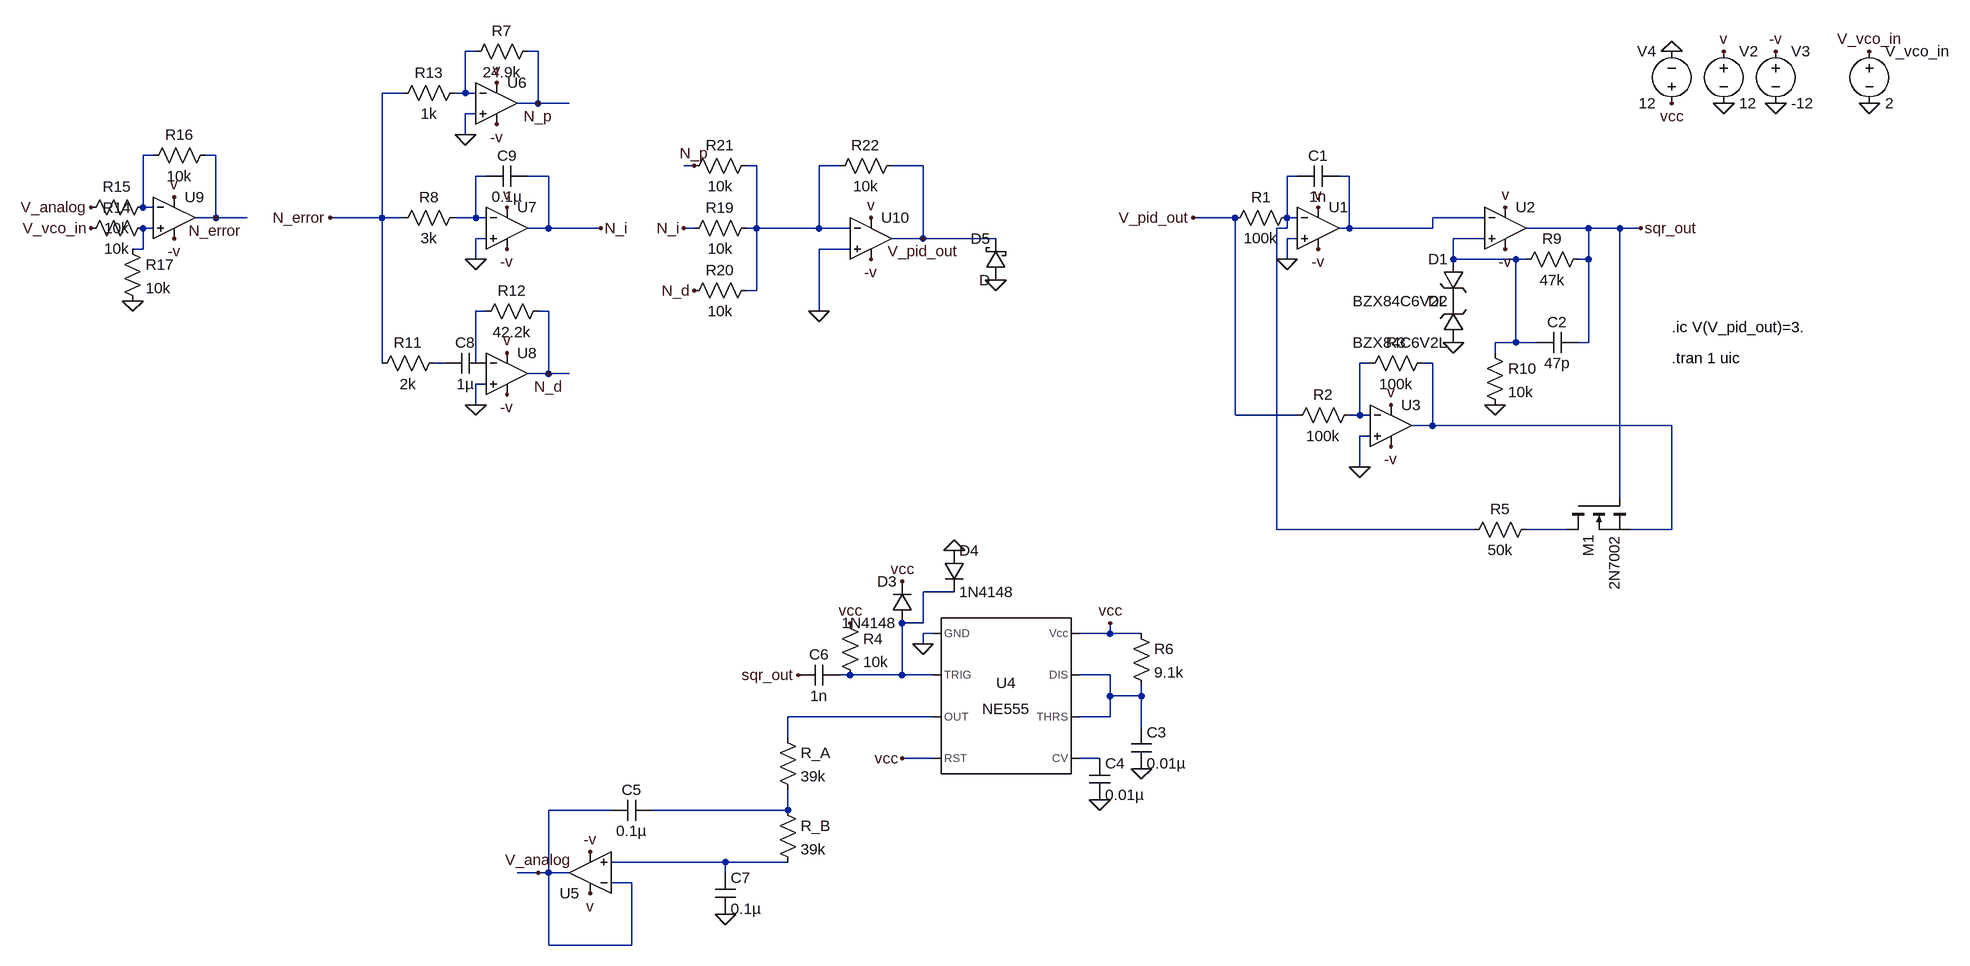
[diagram p0: schematic precision_oscillator_prll_topology.asc]
precision_oscillator_prll_topology.asc, the LTspice schematic file:
Version 4
SHEET 1 3140 2088
WIRE -1888 -1328 -1904 -1328
WIRE -1792 -1328 -1808 -1328
WIRE -2000 -1264 -2032 -1264
WIRE -1904 -1264 -1904 -1328
WIRE -1904 -1264 -1920 -1264
WIRE -1888 -1264 -1904 -1264
WIRE -1792 -1248 -1792 -1328
WIRE -1792 -1248 -1824 -1248
WIRE -1744 -1248 -1792 -1248
WIRE -1888 -1232 -1904 -1232
WIRE -1904 -1200 -1904 -1232
WIRE -2384 -1168 -2400 -1168
WIRE -2288 -1168 -2304 -1168
WIRE -1552 -1152 -1568 -1152
WIRE -1456 -1152 -1472 -1152
WIRE -1328 -1152 -1360 -1152
WIRE -1200 -1152 -1248 -1152
WIRE -1872 -1136 -1888 -1136
WIRE -1776 -1136 -1808 -1136
WIRE -624 -1136 -640 -1136
WIRE -544 -1136 -560 -1136
WIRE -2400 -1088 -2400 -1168
WIRE -2384 -1088 -2400 -1088
WIRE -2288 -1072 -2288 -1168
WIRE -2288 -1072 -2320 -1072
WIRE -2240 -1072 -2288 -1072
WIRE -2032 -1072 -2032 -1264
WIRE -2032 -1072 -2112 -1072
WIRE -2000 -1072 -2032 -1072
WIRE -1888 -1072 -1888 -1136
WIRE -1888 -1072 -1920 -1072
WIRE -1872 -1072 -1888 -1072
WIRE -720 -1072 -784 -1072
WIRE -640 -1072 -640 -1136
WIRE -624 -1072 -640 -1072
WIRE -336 -1072 -416 -1072
WIRE -2384 -1056 -2400 -1056
WIRE -1776 -1056 -1776 -1136
WIRE -1776 -1056 -1808 -1056
WIRE -1696 -1056 -1776 -1056
WIRE -1552 -1056 -1568 -1056
WIRE -1456 -1056 -1456 -1152
WIRE -1456 -1056 -1472 -1056
WIRE -1360 -1056 -1360 -1152
WIRE -1360 -1056 -1456 -1056
WIRE -1312 -1056 -1360 -1056
WIRE -640 -1056 -640 -1072
WIRE -640 -1056 -656 -1056
WIRE -544 -1056 -544 -1136
WIRE -544 -1056 -560 -1056
WIRE -416 -1056 -416 -1072
WIRE -416 -1056 -544 -1056
WIRE -176 -1056 -272 -1056
WIRE -128 -1056 -176 -1056
WIRE -96 -1056 -128 -1056
WIRE -1872 -1040 -1888 -1040
WIRE -1200 -1040 -1200 -1152
WIRE -1200 -1040 -1248 -1040
WIRE -1088 -1040 -1200 -1040
WIRE -624 -1040 -640 -1040
WIRE -336 -1040 -384 -1040
WIRE -2400 -1024 -2400 -1056
WIRE -2400 -1024 -2416 -1024
WIRE -1312 -1024 -1360 -1024
WIRE -1888 -1008 -1888 -1040
WIRE -640 -1008 -640 -1040
WIRE -384 -1008 -384 -1040
WIRE -288 -1008 -384 -1008
WIRE -272 -1008 -288 -1008
WIRE -176 -1008 -176 -1056
WIRE -176 -1008 -192 -1008
WIRE -1456 -960 -1456 -1056
WIRE -1456 -960 -1472 -960
WIRE -1872 -928 -1888 -928
WIRE -1776 -928 -1792 -928
WIRE -1360 -928 -1360 -1024
WIRE -288 -880 -288 -1008
WIRE -288 -880 -320 -880
WIRE -256 -880 -288 -880
WIRE -176 -880 -176 -1008
WIRE -176 -880 -192 -880
WIRE -320 -864 -320 -880
WIRE -2032 -848 -2032 -1072
WIRE -1936 -848 -1952 -848
WIRE -1888 -848 -1888 -928
WIRE -512 -848 -528 -848
WIRE -416 -848 -432 -848
WIRE -1776 -832 -1776 -928
WIRE -1776 -832 -1808 -832
WIRE -1744 -832 -1776 -832
WIRE -1872 -816 -1888 -816
WIRE -1888 -784 -1888 -816
WIRE -720 -768 -720 -1072
WIRE -624 -768 -720 -768
WIRE -528 -768 -528 -848
WIRE -528 -768 -544 -768
WIRE -512 -768 -528 -768
WIRE -416 -752 -416 -848
WIRE -416 -752 -448 -752
WIRE -48 -752 -416 -752
WIRE -512 -736 -528 -736
WIRE -528 -688 -528 -736
WIRE -128 -640 -128 -1056
WIRE -656 -592 -656 -1056
WIRE -352 -592 -656 -592
WIRE -208 -592 -272 -592
WIRE -48 -592 -48 -752
WIRE -48 -592 -112 -592
WIRE -1152 -496 -1200 -496
WIRE -1200 -448 -1200 -496
WIRE -1200 -448 -1232 -448
WIRE -1184 -432 -1200 -432
WIRE -912 -432 -912 -448
WIRE -912 -432 -960 -432
WIRE -864 -432 -912 -432
WIRE -1200 -416 -1200 -432
WIRE -1312 -368 -1328 -368
WIRE -1232 -368 -1232 -448
WIRE -1232 -368 -1312 -368
WIRE -1184 -368 -1232 -368
WIRE -912 -368 -960 -368
WIRE -912 -336 -912 -368
WIRE -864 -336 -864 -352
WIRE -864 -336 -912 -336
WIRE -1184 -304 -1408 -304
WIRE -912 -304 -912 -336
WIRE -912 -304 -960 -304
WIRE -864 -288 -864 -336
WIRE -1408 -272 -1408 -304
WIRE -1184 -240 -1232 -240
WIRE -928 -240 -960 -240
WIRE -1680 -160 -1776 -160
WIRE -1408 -160 -1408 -192
WIRE -1408 -160 -1616 -160
WIRE -1504 -80 -1680 -80
WIRE -1408 -80 -1504 -80
WIRE -1792 -64 -1824 -64
WIRE -1776 -64 -1776 -160
WIRE -1776 -64 -1792 -64
WIRE -1744 -64 -1776 -64
WIRE -1504 -64 -1504 -80
WIRE -1648 -48 -1680 -48
WIRE -1776 48 -1776 -64
WIRE -1648 48 -1648 -48
WIRE -1648 48 -1776 48
FLAG 32 -1248 0
FLAG 112 -1248 0
FLAG -640 -1008 0
FLAG -528 -688 0
FLAG -384 -880 0
FLAG 112 -1328 -v
FLAG 32 -1328 v
FLAG -592 -1088 v
FLAG -304 -1088 v
FLAG -480 -784 v
FLAG -592 -1024 -v
FLAG -304 -1024 -v
FLAG -480 -720 -v
FLAG -48 -1328 0
FLAG -864 -224 0
FLAG -48 -1248 vcc
FLAG -912 -448 vcc
FLAG -1232 -240 vcc
FLAG -928 -176 0
FLAG -96 -1056 sqr_out
FLAG -320 -784 0
FLAG -1312 -448 vcc
FLAG -1200 -416 0
FLAG -1232 -512 vcc
FLAG -1152 -560 0
FLAG -1392 -368 sqr_out
FLAG -1504 0 0
FLAG -1792 -64 V_analog
FLAG -1712 -96 -v
FLAG -1712 -32 v
FLAG 256 -1248 0
FLAG 256 -1328 V_vco_in
FLAG -784 -1072 V_pid_out
FLAG -1904 -1200 0
FLAG -1888 -1008 0
FLAG -1888 -784 0
FLAG -1856 -1280 v
FLAG -1840 -1088 v
FLAG -1840 -864 v
FLAG -1856 -1216 -v
FLAG -1840 -1024 -v
FLAG -1840 -800 -v
FLAG -2112 -1072 N_error
FLAG -1696 -1056 N_i
FLAG -1792 -1248 N_p
FLAG -1776 -832 N_d
FLAG -2480 -1056 V_vco_in
FLAG -2480 -1088 V_analog
FLAG -2416 -944 0
FLAG -2288 -1072 N_error
FLAG -1552 -1152 N_p
FLAG -1568 -1056 N_i
FLAG -1552 -960 N_d
FLAG -1200 -1040 V_pid_out
FLAG -1280 -1072 v
FLAG -1280 -1008 -v
FLAG -1360 -928 0
FLAG -1088 -976 0
FLAG -2352 -1104 v
FLAG -2352 -1040 -v
SYMBOL Voltage 32 -1344 R0
SYMATTR InstName V2
SYMATTR Value 12
SYMBOL Voltage 112 -1344 R0
SYMATTR InstName V3
SYMATTR Value -12
SYMBOL Res -624 -1088 R90
WINDOW 0 0 56 VBottom 2
WINDOW 3 32 56 VTop 2
SYMATTR InstName R1
SYMATTR Value 100k
SYMBOL Res -528 -784 R90
WINDOW 0 0 56 VBottom 2
WINDOW 3 32 56 VTop 2
SYMATTR InstName R2
SYMATTR Value 100k
SYMBOL Res -416 -864 R90
WINDOW 0 0 56 VBottom 2
WINDOW 3 32 56 VTop 2
SYMATTR InstName R3
SYMATTR Value 100k
SYMBOL Cap -560 -1152 R90
WINDOW 0 0 32 VBottom 2
WINDOW 3 32 32 VTop 2
SYMATTR InstName C1
SYMATTR Value 1n
SYMBOL zener -368 -1008 M0
SYMATTR InstName D1
SYMATTR Value BZX84C6V2L
SYMBOL zener -368 -880 R180
WINDOW 0 24 64 Left 2
WINDOW 3 24 0 Left 2
SYMATTR InstName D2
SYMATTR Value BZX84C6V2L
SYMBOL nmos -208 -640 M90
SYMATTR InstName M1
SYMATTR Value 2N7002
SYMBOL Res -256 -608 R90
WINDOW 0 0 56 VBottom 2
WINDOW 3 32 56 VTop 2
SYMATTR InstName R5
SYMATTR Value 50k
SYMBOL OpAmps/UniversalOpAmp2 -592 -1056 R0
SYMATTR InstName U1
SYMBOL OpAmps/UniversalOpAmp2 -304 -1056 R0
SYMATTR InstName U2
SYMBOL OpAmps/UniversalOpAmp2 -480 -752 R0
SYMATTR InstName U3
SYMBOL Misc/NE555 -1072 -336 R0
SYMATTR InstName U4
SYMBOL Cap -880 -288 R0
SYMATTR InstName C3
SYMATTR Value 0.01µ
SYMBOL Voltage -48 -1232 R180
WINDOW 0 24 96 Left 2
WINDOW 3 24 16 Left 2
SYMATTR InstName V4
SYMATTR Value 12
SYMBOL Res -880 -448 R0
SYMATTR InstName R6
SYMATTR Value 9.1k
SYMBOL Cap -944 -240 R0
SYMATTR InstName C4
SYMATTR Value 0.01µ
SYMBOL Res -176 -1024 R90
WINDOW 0 0 56 VBottom 2
WINDOW 3 32 56 VTop 2
SYMATTR InstName R9
SYMATTR Value 47k
SYMBOL Cap -192 -896 R90
WINDOW 0 0 32 VBottom 2
WINDOW 3 32 32 VTop 2
SYMATTR InstName C2
SYMATTR Value 47p
SYMBOL Res -336 -880 R0
SYMATTR InstName R10
SYMATTR Value 10k
SYMBOL Cap -1328 -384 R90
WINDOW 0 0 32 VBottom 2
WINDOW 3 32 32 VTop 2
SYMATTR InstName C6
SYMATTR Value 1n
SYMBOL Res -1328 -464 R0
SYMATTR InstName R4
SYMATTR Value 10k
SYMBOL diode -1216 -448 R180
WINDOW 0 24 64 Left 2
WINDOW 3 24 0 Left 2
SYMATTR InstName D3
SYMATTR Value 1N4148
SYMBOL diode -1168 -560 R0
SYMATTR InstName D4
SYMATTR Value 1N4148
SYMBOL OpAmps/UniversalOpAmp2 -1712 -64 R180
SYMATTR InstName U5
SYMBOL Res -1424 -288 R0
SYMATTR InstName R_A
SYMATTR Value 39k
SYMBOL Cap -1616 -176 R90
WINDOW 0 0 32 VBottom 2
WINDOW 3 32 32 VTop 2
SYMATTR InstName C5
SYMATTR Value 0.1µ
SYMBOL Cap -1520 0 M180
WINDOW 0 24 56 Left 2
WINDOW 3 24 8 Left 2
SYMATTR InstName C7
SYMATTR Value 0.1µ
SYMBOL Res -1424 -176 R0
SYMATTR InstName R_B
SYMATTR Value 39k
SYMBOL Voltage 256 -1344 R0
SYMATTR InstName V_vco_in
SYMATTR Value 2
SYMBOL OpAmps/UniversalOpAmp2 -1856 -1248 R0
SYMATTR InstName U6
SYMBOL OpAmps/UniversalOpAmp2 -1840 -1056 R0
SYMATTR InstName U7
SYMBOL OpAmps/UniversalOpAmp2 -1840 -832 R0
SYMATTR InstName U8
SYMBOL Res -1792 -1344 R90
WINDOW 0 0 56 VBottom 2
WINDOW 3 32 56 VTop 2
SYMATTR InstName R7
SYMATTR Value 24.9k
SYMBOL Res -1904 -1088 R90
WINDOW 0 0 56 VBottom 2
WINDOW 3 32 56 VTop 2
SYMATTR InstName R8
SYMATTR Value 3k
SYMBOL Res -1936 -864 R90
WINDOW 0 0 56 VBottom 2
WINDOW 3 32 56 VTop 2
SYMATTR InstName R11
SYMATTR Value 2k
SYMBOL Res -1776 -944 R90
WINDOW 0 0 56 VBottom 2
WINDOW 3 32 56 VTop 2
SYMATTR InstName R12
SYMATTR Value 42.2k
SYMBOL Cap -1872 -864 R90
WINDOW 0 0 32 VBottom 2
WINDOW 3 32 32 VTop 2
SYMATTR InstName C8
SYMATTR Value 1µ
SYMBOL Cap -1808 -1152 R90
WINDOW 0 0 32 VBottom 2
WINDOW 3 32 32 VTop 2
SYMATTR InstName C9
SYMATTR Value 0.1µ
SYMBOL Res -1904 -1280 R90
WINDOW 0 0 56 VBottom 2
WINDOW 3 32 56 VTop 2
SYMATTR InstName R13
SYMATTR Value 1k
SYMBOL OpAmps/UniversalOpAmp2 -2352 -1072 R0
SYMATTR InstName U9
SYMBOL Res -2384 -1072 R90
WINDOW 0 0 56 VBottom 2
WINDOW 3 32 56 VTop 2
SYMATTR InstName R14
SYMATTR Value 10k
SYMBOL Res -2384 -1104 R90
WINDOW 0 0 56 VBottom 2
WINDOW 3 32 56 VTop 2
SYMATTR InstName R15
SYMATTR Value 10k
SYMBOL Res -2288 -1184 R90
WINDOW 0 0 56 VBottom 2
WINDOW 3 32 56 VTop 2
SYMATTR InstName R16
SYMATTR Value 10k
SYMBOL Res -2432 -1040 R0
SYMATTR InstName R17
SYMATTR Value 10k
SYMBOL OpAmps/UniversalOpAmp2 -1280 -1040 R0
SYMATTR InstName U10
SYMBOL Res -1456 -1072 R90
WINDOW 0 0 56 VBottom 2
WINDOW 3 32 56 VTop 2
SYMATTR InstName R19
SYMATTR Value 10k
SYMBOL Res -1456 -976 R90
WINDOW 0 0 56 VBottom 2
WINDOW 3 32 56 VTop 2
SYMATTR InstName R20
SYMATTR Value 10k
SYMBOL Res -1456 -1168 R90
WINDOW 0 0 56 VBottom 2
WINDOW 3 32 56 VTop 2
SYMATTR InstName R21
SYMATTR Value 10k
SYMBOL Res -1232 -1168 R90
WINDOW 0 0 56 VBottom 2
WINDOW 3 32 56 VTop 2
SYMATTR InstName R22
SYMATTR Value 10k
SYMBOL schottky -1072 -976 R180
WINDOW 0 24 64 Left 2
WINDOW 3 24 0 Left 2
SYMATTR InstName D5
TEXT -48 -856 Left 2 !.tran 1 uic
TEXT -48 -904 Left 2 !.ic V(V_pid_out)=3.

The netlist it stands for:
* precision_oscillator_prll_topology.asc
V2 v 0 12
V3 -v 0 -12
R1 N005 V_pid_out 100k
R2 N011 V_pid_out 100k
R3 N012 N011 100k
C1 N006 N005 1n
D1 N008 P001 BZX84C6V2L
D2 0 P001 BZX84C6V2L
M1 N013 sqr_out N012 N012 2N7002
R5 N013 N005 50k
XU1 0 N005 v -v N006 level2 Avol=1Meg GBW=10Meg Slew=10Meg Ilimit=25m Rail=0 Vos=0 En=0 Enk=0 In=0 Ink=0 Rin=500Meg  ; pins In+ In- V+ V- OUT
XU2 N008 N006 v -v sqr_out level2 Avol=1Meg GBW=10Meg Slew=10Meg Ilimit=25m Rail=0 Vos=0 En=0 Enk=0 In=0 Ink=0 Rin=500Meg  ; pins In+ In- V+ V- OUT
XU3 0 N011 v -v N012 level2 Avol=1Meg GBW=10Meg Slew=10Meg Ilimit=25m Rail=0 Vos=0 En=0 Enk=0 In=0 Ink=0 Rin=500Meg  ; pins In+ In- V+ V- OUT
XU4 0 N014 N016 vcc N017 N015 N015 vcc NE555  ; pins GND TRIG OUT RST CV THRS DIS Vcc
C3 N015 0 0.01µ
V4 vcc 0 12
R6 vcc N015 9.1k
C4 N017 0 0.01µ
R9 sqr_out N008 47k
C2 sqr_out N008 47p
R10 N008 0 10k
C6 N014 sqr_out 1n
R4 vcc N014 10k
D3 N014 vcc 1N4148
D4 0 N014 1N4148
XU5 N019 V_analog v -v V_analog level2 Avol=1Meg GBW=10Meg Slew=10Meg Ilimit=25m Rail=0 Vos=0 En=0 Enk=0 In=0 Ink=0 Rin=500Meg  ; pins In+ In- V+ V- OUT
R_A N016 N018 39k
C5 N018 V_analog 0.1µ
C7 0 N019 0.1µ
R_B N018 N019 39k
V_vco_in V_vco_in 0 2
XU6 0 N001 v -v N_p level2 Avol=1Meg GBW=10Meg Slew=10Meg Ilimit=25m Rail=0 Vos=0 En=0 Enk=0 In=0 Ink=0 Rin=500Meg  ; pins In+ In- V+ V- OUT
XU7 0 N004 v -v N_i level2 Avol=1Meg GBW=10Meg Slew=10Meg Ilimit=25m Rail=0 Vos=0 En=0 Enk=0 In=0 Ink=0 Rin=500Meg  ; pins In+ In- V+ V- OUT
XU8 0 P002 v -v N_d level2 Avol=1Meg GBW=10Meg Slew=10Meg Ilimit=25m Rail=0 Vos=0 En=0 Enk=0 In=0 Ink=0 Rin=500Meg  ; pins In+ In- V+ V- OUT
R7 N_p N001 24.9k
R8 N004 N_error 3k
R11 N010 N_error 2k
R12 N_d N009 42.2k
C8 P002 N010 1µ
C9 N_i N004 0.1µ
R13 N001 N_error 1k
XU9 N007 N002 v -v N_error level2 Avol=1Meg GBW=10Meg Slew=10Meg Ilimit=25m Rail=0 Vos=0 En=0 Enk=0 In=0 Ink=0 Rin=500Meg  ; pins In+ In- V+ V- OUT
R14 N007 V_vco_in 10k
R15 N002 V_analog 10k
R16 N_error N002 10k
R17 N007 0 10k
XU10 0 N003 v -v V_pid_out level2 Avol=1Meg GBW=10Meg Slew=10Meg Ilimit=25m Rail=0 Vos=0 En=0 Enk=0 In=0 Ink=0 Rin=500Meg  ; pins In+ In- V+ V- OUT
R19 N003 N_i 10k
R20 N003 N_d 10k
R21 N003 N_p 10k
R22 V_pid_out N003 10k
D5 0 V_pid_out D
.model D D
.lib standard.dio
.model NMOS NMOS
.model PMOS PMOS
.lib standard.mos
.tran 1 uic
.ic V(V_pid_out)=3.
.lib UniversalOpAmp2.lib
.lib NE555.sub
.backanno
.end